# Altium schematic sheet R Phase Sense Signal Isolation.SchDoc: R Phase Sense Signal Isolation
size 292 x 193 mm; SheetNumber: 3; SheetTotal: 12
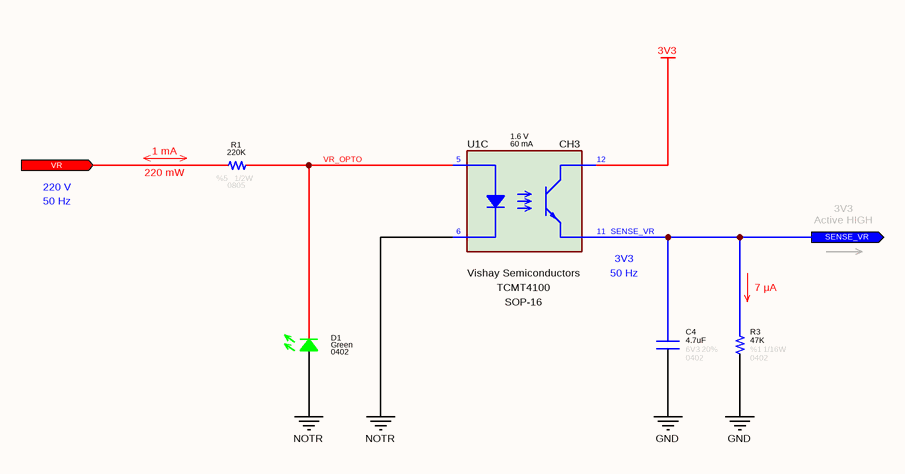
[diagram p0: R Phase Sense Signal Isolation.SchDoc]

## Parts
C4  value 4.7uF  Tolerance: 20%  Case: 0402  Voltage: 6V3  [CAPACITOR_0402]  (hidden comment: Capacitor - 4.7uF [0402] (Ceramic))
D1  Case: 0402  Color: Green  [LED_0402]  (hidden comment: SMD LED (Green))
R1  value 220K  Case: 0805  Tolerance: %5  Power: 1/2W  [RESISTOR_0805]  (hidden comment: 220K - 0805 - %5 - 1/16W)
R3  value 47K  Tolerance: %1  Case: 0402  Power: 1/16W  [RESISTOR_0402]  (hidden comment: 47K - 0402 - %1 - 1/16W)
U1  If - Forward Current: 60 mA  Vf - Forward Voltage: 1.6 V  Manufacturer Name: Vishay Semiconductors  Case: SOP-16  [SO-16]  (hidden comment: TCMT4100)  (part C of 4)

## Ports
SENSE_VR (out), VR (in)

## Nets
3V3: U1.12(Collector_CH3)
GND: C4.1 R3.1
NOTR: D1.2 U1.6(Cathode_CH3)
SENSE_VR: C4.2 R3.2 U1.11(Emiter_CH3) ; port SENSE_VR
VR: R1.2 ; port VR
VR_OPTO: D1.1 R1.1 U1.5(Anode_CH3)

## Notes on the sheet
- (near R1) 1 mA
- 220 V
- 50 Hz
- (near R1) 220 mW
- 3V3
  Active HIGH
- (near U1) 3V3
- (near R3) 7 μA
- © 2021 All rights reserved.
  This document may not, in whole or in part, be copied, photocopied, reproduced, translated or converted to any electronic or machine readable from without prior written permission of Mehmet Günce Akkoyun.
  Engineer contact : akkoyun@me.com
- Property of
- Engineer :
- Date :
- Size :
- A4
- Time :
- Project :
- Page :
- /
- Customer :
- Product ID :
- Module ID :
- Version :
- File :
- Revision :
- (in symbol IC - TCMT4100, part C) CH3

## Library data of the parts
C4 = Capacitor - 4.7uF [0402-6V3]: Multilayer Ceramic Capacitors - SMD - 6V3 4.7uF X5R 0402 20%; Manufacturer Part Number: C0402C475M9PACTU; Manufacturer Name: KEMET
D1 = Diode - LED (0402-Green): Standard LEDs - SMD MINI-MOLD ULTRA COMPACT GREEN; Manufacturer Name: ROHM Semiconductor; Manufacturer Part Number: SML-P12MTT86R; ROHS: Yes; ComponentLink1Description: DataSheet; ComponentLink1URL: https://www.mouser.com.tr/datasheet/2/348/sml-p1-e-1139198.pdf; ComponentLink2Description: Mouser; ComponentLink2URL: https://www.mouser.com.tr/ProductDetail/ROHM-Semiconductor/SML-P12U2TT86R?qs=sGAEpiMZZMseGfSY3csMkRIBDsfU3UCXJTULB5gem9Ta%252Bp%252BvZ709fg%3D%3D
R1 = Resistor - 220K [0805]: Thick Film Resistors - SMD 1/2 W 220 KOhm 5%; Manufacturer Name: Vishay Dale; Manufacturer Part Number: CRCW0805220KJNEAHP; ComponentLink1Description: DataSheet; ComponentLink1URL: https://www.mouser.com.tr/datasheet/2/427/dcrcwe3-1762152.pdf; ComponentLink2Description: Mouser; ComponentLink2URL: https://www.mouser.com.tr/ProductDetail/Vishay-Dale/CRCW0402330RFKED?qs=sGAEpiMZZMu61qfTUdNhG2DpbjADlD3GGS6SwBlLi5Q%3D
R3 = Resistor - 47K [0402]: Thick Film Resistors - SMD 1/16 W 47 KOhm 1%; Manufacturer Name: Vishay; Manufacturer Part Number: CRCW040247K0FKED; ComponentLink1Description: DataSheet; ComponentLink1URL: https://www.mouser.com.tr/datasheet/2/427/dcrcwe3-1762152.pdf; ComponentLink2Description: Mouser; ComponentLink2URL: https://www.mouser.com.tr/ProductDetail/Vishay-Dale/CRCW040247K0FKED?qs=sGAEpiMZZMu61qfTUdNhG2DpbjADlD3GL%252B3h1elTxqU%3D
U1 = IC - TCMT4100: OptpCoupler 4CH 16 Pin (SOP16); Number of Channels: 4 Channel; Maximum Collector Emitter Saturation Voltage: 0.3 V; Manufacturer Part Number: TCMT4100